# Altium schematic sheet Unknown WaterSensor.SCHDOC
size A3; SheetNumber: 1; SheetTotal: 1; DocumentName: Sheet1.SCHDOC
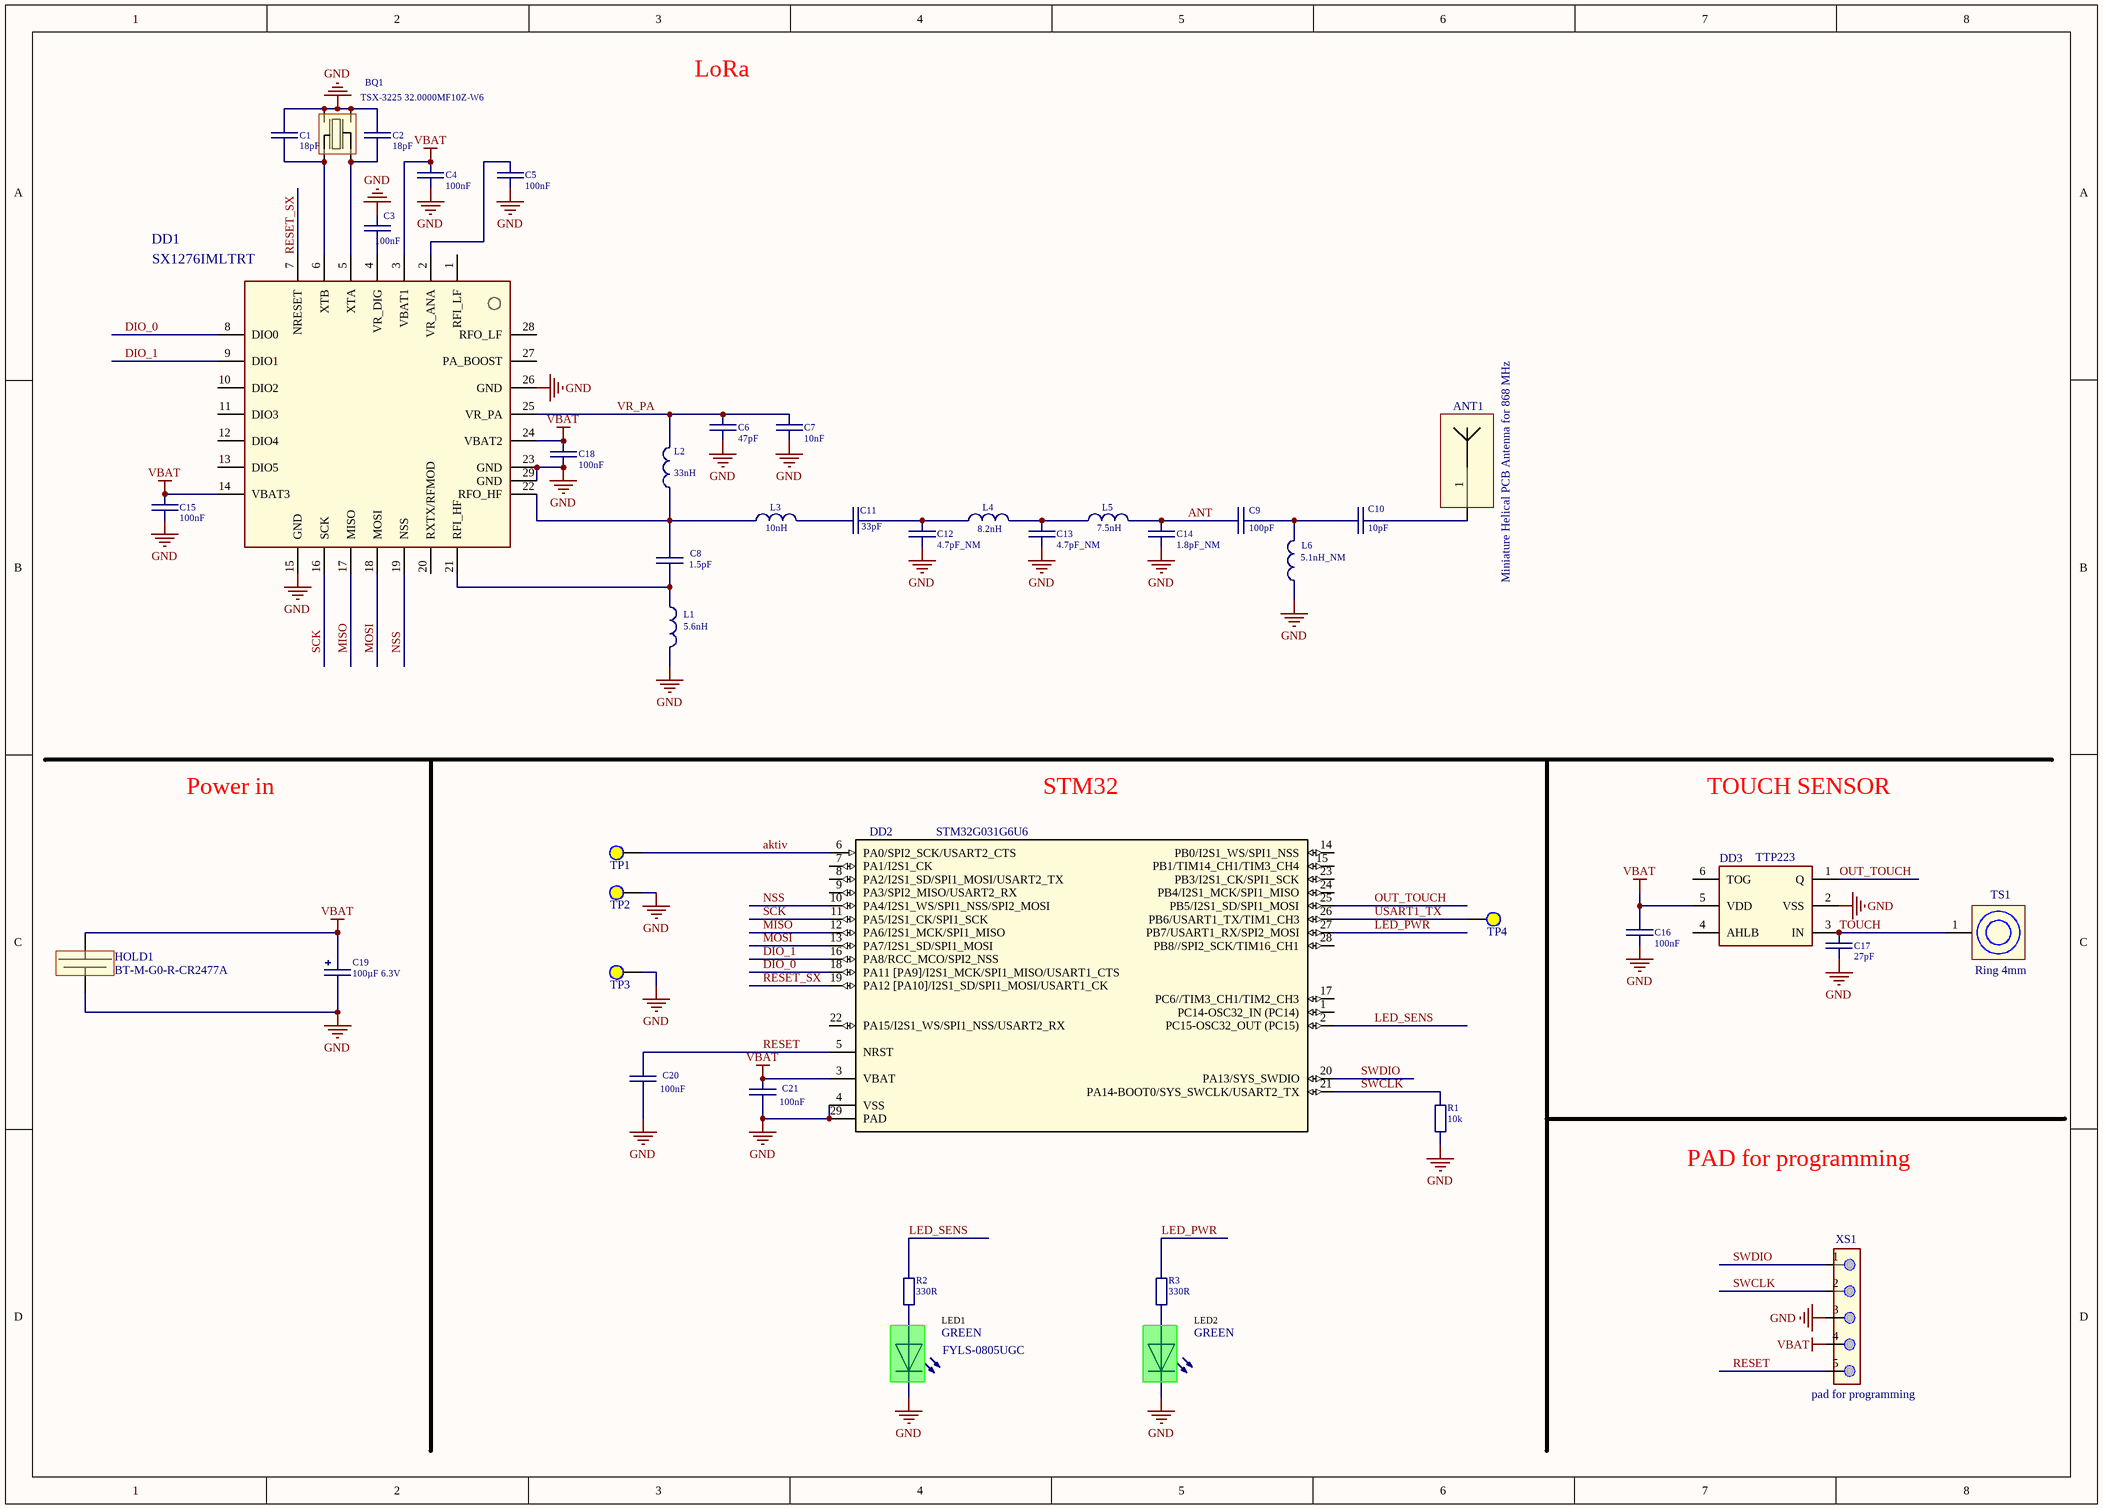
[diagram p0: Unknown WaterSensor.SCHDOC]

## Parts
ANT1  Miniature Helical PCB Antenna for 868 MHz  [ANTENNA868_915MHZ_A2N]  (no BOM)
BQ1  TSX-3225 32.0000MF10Z-W6  [3225]
C1  Capacitance: 18pF  [C0402]  (hidden comment: C0402, 18pF, C0G)
C2  Capacitance: 18pF  [C0402]  (hidden comment: C0402, 18pF, C0G)
C3  Capacitance: 100nF  [C0402]  (hidden comment: C0402, 100nF,  16V, X7R)
C4  Capacitance: 100nF  [C0402]  (hidden comment: C0402, 100nF,  16V, X7R)
C5  Capacitance: 100nF  [C0402]  (hidden comment: C0402, 100nF,  16V, X7R)
C6  Capacitance: 47pF  [C0402]  (hidden comment: C0402, 47pF, C0G)
C7  Capacitance: 10nF  [C0402]  (hidden comment: C0402, 10nF, X7R)
C8  Capacitance: 1.5pF  [C0402]  (hidden comment: C0402, 1.5pF, C0G)
C9  Capacitance: 100pF  [C0402]  (hidden comment: C0402, 100pF,  50V)
C10  Capacitance: 10pF  [C0402]  (hidden comment: C0402, 10pF,  50V)
C11  Capacitance: 33pF  [C0402]  (hidden comment: C0402, 33pF, C0G)
C12  Capacitance: 4.7pF_NM  [C0402]  (hidden comment: C0402, 4.7pF, C0G_NOT_MOUNT)
C13  Capacitance: 4.7pF_NM  [C0402]  (hidden comment: C0402, 4.7pF, C0G_NOT_MOUNT)
C14  Capacitance: 1.8pF_NM  [C0402]  (hidden comment: C0402, 1.8pF, C0G_NOT_MOUNT)
C15  Capacitance: 100nF  [C0402]  (hidden comment: C0402, 100nF,  16V, X7R)
C16  Capacitance: 100nF  [C0402]  (hidden comment: C0402, 100nF,  16V, X7R)
C17  Capacitance: 27pF  [C0402]  (hidden comment: C0402, 27pF, C0G)
C18  Capacitance: 100nF  [C0402]  (hidden comment: C0402, 100nF,  16V, X7R)
C19  865080142007  [WCAP-ASLI_5x5.5]  (value not drawn)
C20  Capacitance: 100nF  [C0402]  (hidden comment: C0402, 100nF,  16V, X7R)
C21  Capacitance: 100nF  [C0402]  (hidden comment: C0402, 100nF,  16V, X7R)
DD1  SX1276IMLTRT  [vqfn28_6x6mm]
DD2  STM32G031G6U6  [UFQFPN-28]
DD3  TTP223  [SOT23-6]
HOLD1  BT-M-G0-R-CR2477A  [SMTU2477N-LF]
L1  LQG15HS5N6C02D  [L0402]  (value not drawn)
L2  LQW15AN33NJ00D  [L0402]  (value not drawn)
L3  LQG15HS10NJ02D  [L0402]  (value not drawn)
L4  LQG15HS8N2J02D  [L0402]  (value not drawn)
L5  LQG15HS7N5J02D  [L0402]  (value not drawn)
L6  LQG15HN5N1S02D_NOT_MOUNT  [L0402]  (value not drawn)
LED1  FYLS-0805UGC  [LED_0805_G]
LED2  FYLS-0805UGC  [LED_0805_G]  (value not drawn)
R1  Resistance: 10k  [R0402]  (hidden comment: R0402, 10k 1%)
R2  Resistance: 330R  [R0402]  (hidden comment: R0402, 330R 5%)
R3  Resistance: 330R  [R0402]  (hidden comment: R0402, 330R 5%)
TP1  Test Point 1mm pad  [Test Point 1mm]  (value not drawn)  (no BOM)
TP2  Test Point 1mm pad  [Test Point 1mm]  (value not drawn)  (no BOM)
TP3  Test Point 1mm pad  [Test Point 1mm]  (value not drawn)  (no BOM)
TP4  Test Point 1mm pad  [Test Point 1mm]  (value not drawn)  (no BOM)
TS1  Ring 4mm  [Ring 4mm]  (no BOM)
XS1  pad for programming  [pad for programming 5x2mm]  (no BOM)

## Nets
GND: BQ1.2(GND) BQ1.4(GND) C1.2 C2.2 C3.1 C4.2 C5.2 C6.1 C7.1 C12.1 C13.1 C14.1 C15.2 C16.2 C17.1 C18.2 C19.1 C20.2 C21.2 DD1.15(GND) DD1.23(GND) DD1.26(GND) DD1.29(GND) DD2.4(VSS) DD2.29(PAD) DD3.2(VSS) HOLD1.2 L1.2 L6.1 LED1.1(K) LED2.1(K) R1.2 TP2.1 TP3.1 XS1.3
VBAT: C4.1 C15.1 C16.1 C18.1 C19.2 C21.1 DD1.3(VBAT1) DD1.14(VBAT3) DD1.24(VBAT2) DD2.3(VBAT) DD3.5(VDD) HOLD1.1 XS1.4
aktiv: DD2.6(PA0/SPI2_SCK/USART2_CTS) TP1.1
ANT: C9.1 C14.2 L5.2
DIO_0: DD1.8(DIO0) DD2.18(PA11_[PA9]/I2S1_MCK/SPI1_MISO/USART1_CTS)
DIO_1: DD1.9(DIO1) DD2.16(PA8/RCC_MCO/SPI2_NSS)
LED_PWR: DD2.27(PB7/USART1_RX/SPI2_MOSI) R3.2
LED_SENS: DD2.2(PC15-OSC32_OUT_(PC15)) R2.2
MISO: DD1.17(MISO) DD2.12(PA6/I2S1_MCK/SPI1_MISO)
MOSI: DD1.18(MOSI) DD2.13(PA7/I2S1_SD/SPI1_MOSI)
NSS: DD1.19(NSS) DD2.10(PA4/I2S1_WS/SPI1_NSS/SPI2_MOSI)
OUT_TOUCH: DD2.25(PB5/I2S1_SD/SPI1_MOSI) DD3.1(Q)
RESET: C20.1 DD2.5(NRST) XS1.5
RESET_SX: DD1.7(NRESET) DD2.19(PA12_[PA10]/I2S1_SD/SPI1_MOSI/USART1_CK)
SCK: DD1.16(SCK) DD2.11(PA5/I2S1_CK/SPI1_SCK)
SWCLK: DD2.21(PA14-BOOT0/SYS_SWCLK/USART2_TX) R1.1 XS1.2
SWDIO: DD2.20(PA13/SYS_SWDIO) XS1.1
TOUCH: C17.2 DD3.3(IN) TS1.1
USART1_TX: DD2.26(PB6/USART1_TX/TIM1_CH3) TP4.1
VR_PA: C6.2 C7.2 DD1.25(VR_PA) L2.2
NetANT1_1: ANT1.1 C10.2
NetBQ1_1: BQ1.1 C2.1 DD1.5(XTA)
NetBQ1_3: BQ1.3 C1.1 DD1.6(XTB)
NetC3_2: C3.2 DD1.4(VR_DIG)
NetC5_1: C5.1 DD1.2(VR_ANA)
NetC8_1: C8.1 DD1.21(RFI_HF) L1.1
NetC8_2: C8.2 DD1.22(RFO_HF) L2.1 L3.1
NetC9_2: C9.2 C10.1 L6.2
NetC11_1: C11.1 L3.2
NetC11_2: C11.2 C12.2 L4.1
NetC13_2: C13.2 L4.2 L5.1
NetLED1_2: LED1.2(A) R2.1
NetLED2_2: LED2.2(A) R3.1

Not connected (* = marked no-connect by the designer): DD1 1(RFI_LF) 10(DIO2) 11(DIO3) 12(DIO4) 13(DIO5) 20(RXTX/RFMOD) 27(PA_BOOST) 28(RFO_LF); DD2 1(PC14-OSC32_IN_(PC14)) 7(PA1/I2S1_CK) 8(PA2/I2S1_SD/SPI1_MOSI/USART2_TX) 9(PA3/SPI2_MISO/USART2_RX) 14(PB0/I2S1_WS/SPI1_NSS) 15(PB1/TIM14_CH1/TIM3_CH4) 17(PC6//TIM3_CH1/TIM2_CH3) 22(PA15/I2S1_WS/SPI1_NSS/USART2_RX) 23(PB3/I2S1_CK/SPI1_SCK) 24(PB4/I2S1_MCK/SPI1_MISO) 28(PB8//SPI2_SCK/TIM16_CH1); DD3 4(AHLB) 6(TOG)

## Notes on the sheet
- LoRa
- Power in
- (near DD2) STM32
- TOUCH SENSOR
- PAD for programming
- (in symbol 865080142007) 100µF 6.3V
- (in symbol FYLS-0805UGC) GREEN
- (in symbol LQG15HN5N1S02D) 5.1nH_NM
- (in symbol LQG15HS5N6C02D) 5.6nH
- (in symbol LQG15HS7N5J02D) 7.5nH
- (in symbol LQG15HS8N2J02D) 8.2nH
- (in symbol LQG15HS10NJ02D) 10nH
- (in symbol LQW15AN33NJ00D) 33nH

## Library data of the parts
BQ1 = TSX-3225 32.0000MF10Z-W6: 32MHz ±10ppm Crystal 12pF 40 Ohms 4-SMD (3.20mm x 2.50mm); MOUNTING: SMD; Value: 32MHz
C3-C5 C15 C16 C18 C20 C21 = C0402, 100nF,  16V, X7R: Manufacturer: MURATA; Manufacturer Part Number: GRM155R71C104KA88D; Capacitance Tolerance: ± 10%; Dielectric Characteristic: X7; Voltage Rating: 16; Capacitor Case Style: 0402 [1005 Metric]; Capacitor Terminals: SMD; SVHC: No SVHC (19-Dec-2012); No. of Pins: 2; Reel Quantity: 10000; Tolerance +: 10%; Supplier 1: Farnell; Supplier Part Number 1: 1118151; RoHS: YES; Stock: 3; Pricing: 10000=0.008593, 30000=0.007991 (GBP); Operating Temperature Min: -55; Operating Temperature Max: 125; Operating Temperature Range: -55°C to +125; Package / Case: 0402; Packaging: Reel; Series: GRM Hi-Cap; Terminal Type: Surface Mount (SMD, SMT); Tolerance -: 10%; Voltage Rating V DC: 16; ComponentLink1URL: http://www.farnell.com/datasheets/4360.pdf; ComponentLink1Description: http://www.farnell.com/datasheets/4360.pdf
C12 C13 = C0402, 4.7pF, C0G
C14 = C0402, 1.8pF, C0G
C19 = 865080142007: Aluminium Electrolytic Capacitors - SMD WCAP-ASLI 100uF 6.3V 20% SMD/SMT
DD1 = SX1276IMLTRT: SX1276 - Low Power Integrated UHF Transceiver with loRa Modem
DD2 = STM32G031G6U6: ARM® Cortex®-M0+ STM32G0 Microcontroller IC 32-Bit 64MHz 32KB (32K x 8) FLASH 28-UFQFPN (4x4)
DD3 = TTP223: 1 KEY TOUCH PAD DETECTOR IC; Organization: 8 K x 8
HOLD1 = SMTU2477N-LF: Coin Cell Battery Holders FOR CR2477N, SMD
L1 = LQG15HS5N6C02D: L0402, 5.6nH
L2 = LQW15AN33NJ00D: L0402, 33nH
L3 = LQG15HS10NJ02D: L0402, 10nH
L4 = LQG15HS8N2J02D: L0402, 8.2nH
L5 = LQG15HS7N5J02D: L0402, 7.5nH
L6 = LQG15HN5N1S02D: L0402, 5.1nH_NOT_MOUNT
LED1 LED2 = FYLS-0805UGC: LED, GREEN, 0805
R1 = R0402, 10k 1%: Part Number: RC0402JR-0710KL_YAGEO; Value: 10k 1%; ALTERNATE: *; MOUNTING: SMD
R2 R3 = R0402, 330R 5%: Manufacturer: Panasonic Electronic Components; Manufacturer Part Number: ERJ-2GEJ331X; Voltage Rating: 50 Volts; Temperature Coefficient: 200 PPM / C; Power Rating: 100 mWatts; Operating Temperature Range: - 55 C to + 155 C; Package / Case: 0402 (1005 metric); Reeling: True; Termination Style: SMD/SMT; RoHS - Mouser: E; Series: ERJ; Product: Thick Film Resistors SMD; Standard Pack Qty: 10000; Tolerance: 5 %; Product Category: .; Minimum Order Quantity: 1; Dimensions: 0.5 mm W x 1 mm L x 0.35 mm H; RoHS: RoHS Compliant By Exemption; Supplier Part Number: 667-ERJ-2GEJ331X; Supplier: Mouser; Category: Thick Film Resistors - SMD; Packaging: Reel; ComponentLink1URL: http://industrial.panasonic.com/www-data/pdf/AOA0000/AOA0000CE1.pdf; ComponentLink1Description: http://industrial.panasonic.com/www-data/pdf/AOA0000/AOA0000CE1.pdf; Pricing: 1=0.095, 25=0.041, 100=0.034, 250=0.027, 500=0.020, 1000=0.014, 2000=0.011, 5000=0.008, 10000=0.004 (AUD)
TS1 = Ring 4mm: touch spring 13x8.5mm
XS1 = pad for programming 5x2mm